# Altium schematic sheet SL_Config_2E.SchDoc: FPGA Configuration
size A; Organization: Altium Limited; Address1: L3, 12a Rodborough Rd; Address2: Frenchs Forest; Address3: NSW; Address4: Australia 2086; DocumentNumber: 2; SheetNumber: 2; SheetTotal: 5; Library Name: SpiritLevel_2E.SchLib
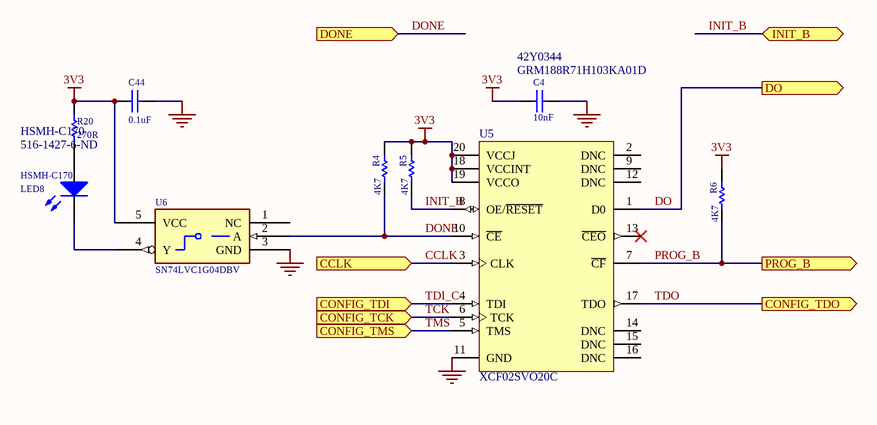
[diagram p0: SL_Config_2E.SchDoc]

## Parts
C4  10nF  Supplier Part Number 1: GRM188R71H103KA01D  Supplier Part Number 2: 42Y0344  [CC1608-0603]
C44  0.1uF  [CC2012-0805]
LED8  HSMH-C170  Supplier Part Number 1: 516-1427-6-ND  [SMD _LED]
R4  4K7  [CR2012-0805]
R5  4K7  [CR2012-0805]
R6  4K7  [CR2012-0805]
R20  270R  [CR2012-0805]
U5  XCF02SVO20C  [VO20]
U6  SN74LVC1G04DBV  [SO-G5/P.95]

## Ports
CCLK (in), CONFIG_TCK (in), CONFIG_TDI (in), CONFIG_TDO (out), CONFIG_TMS (in), DO (out), DONE (in), INIT_B (bidir), PROG_B (out)

## Nets
3V3: C4.1 C44.2 R4.1 R5.1 R6.1 R20.2 U5.18(VCCINT) U5.19(VCCO) U5.20(VCCJ) U6.5(VCC)
GND: C4.2 C44.1 U5.11(GND) U6.3(GND)
CCLK: U5.3(CLK) ; port CCLK
DO: U5.1(D0) ; port DO
DONE: R4.2 U5.10(~{CE}) U6.2(A) ; port DONE
INIT_B: R5.2 U5.8(OE/~{RESET}) ; port INIT_B
PROG_B: R6.2 U5.7(~{CF}) ; port PROG_B
TCK: U5.6(TCK) ; port CONFIG_TCK
TDI_C: U5.4(TDI) ; port CONFIG_TDI
TDO: U5.17(TDO) ; port CONFIG_TDO
TMS: U5.5(TMS) ; port CONFIG_TMS
NetLED8_1: LED8.1(A) R20.1
NetLED8_2: LED8.2(K) U6.4(Y)

Not connected (* = marked no-connect by the designer): U5 2(DNC) 9(DNC) 12(DNC) 13(~{CEO})* 14(DNC) 15(DNC) 16(DNC); U6 1(NC)

## Notes on the sheet
- Title
- Size:
- Date:
- A
- Number:
- Time:
- Revision:
- Sheet
- of
- File:

## Library data of the parts
C4 = CAP: Capacitor; AEMS Code: 2100341; Supplier 1: Verical; Supplier 2: Newark
C44 = CAP: Capacitor; Supplier: FARNELL; Supplier Code: 317-287
LED8 = HSMX-C670: Typical RED GaAs SMD LED Agilent make; AEMS Code: 2610081; Revision: July-2002: Re-released for DXP Platform.; Supplier 1: Digi-Key; Supplier 2: Verical; Supplier Part Number 2: HSMH-C170
R4-R6 = RES: Resistor; AEMS Code: 1200226
R20 = RES: Resistor; AEMS Code: 1200430
U5 = XCF02SVO20C: XCF00S Series, Platform Flash In-System Programmable Configuration 3.3V PROM, 20-Pin TSOP, 2-Megabit, Commercial Grade; PackageDocument: ver1.0, May-2003; AEMS Code: CHANGED VALUE; DatasheetDocument: ver2.3, May-2004; PackageReference: VO20; Code_JEDEC: MO-153-AC
U6 = SN74AHC1G04DBVR: Manufacturer: TI